# EAGLE design Poludapter_v2 (EAGLE 9.1.1)
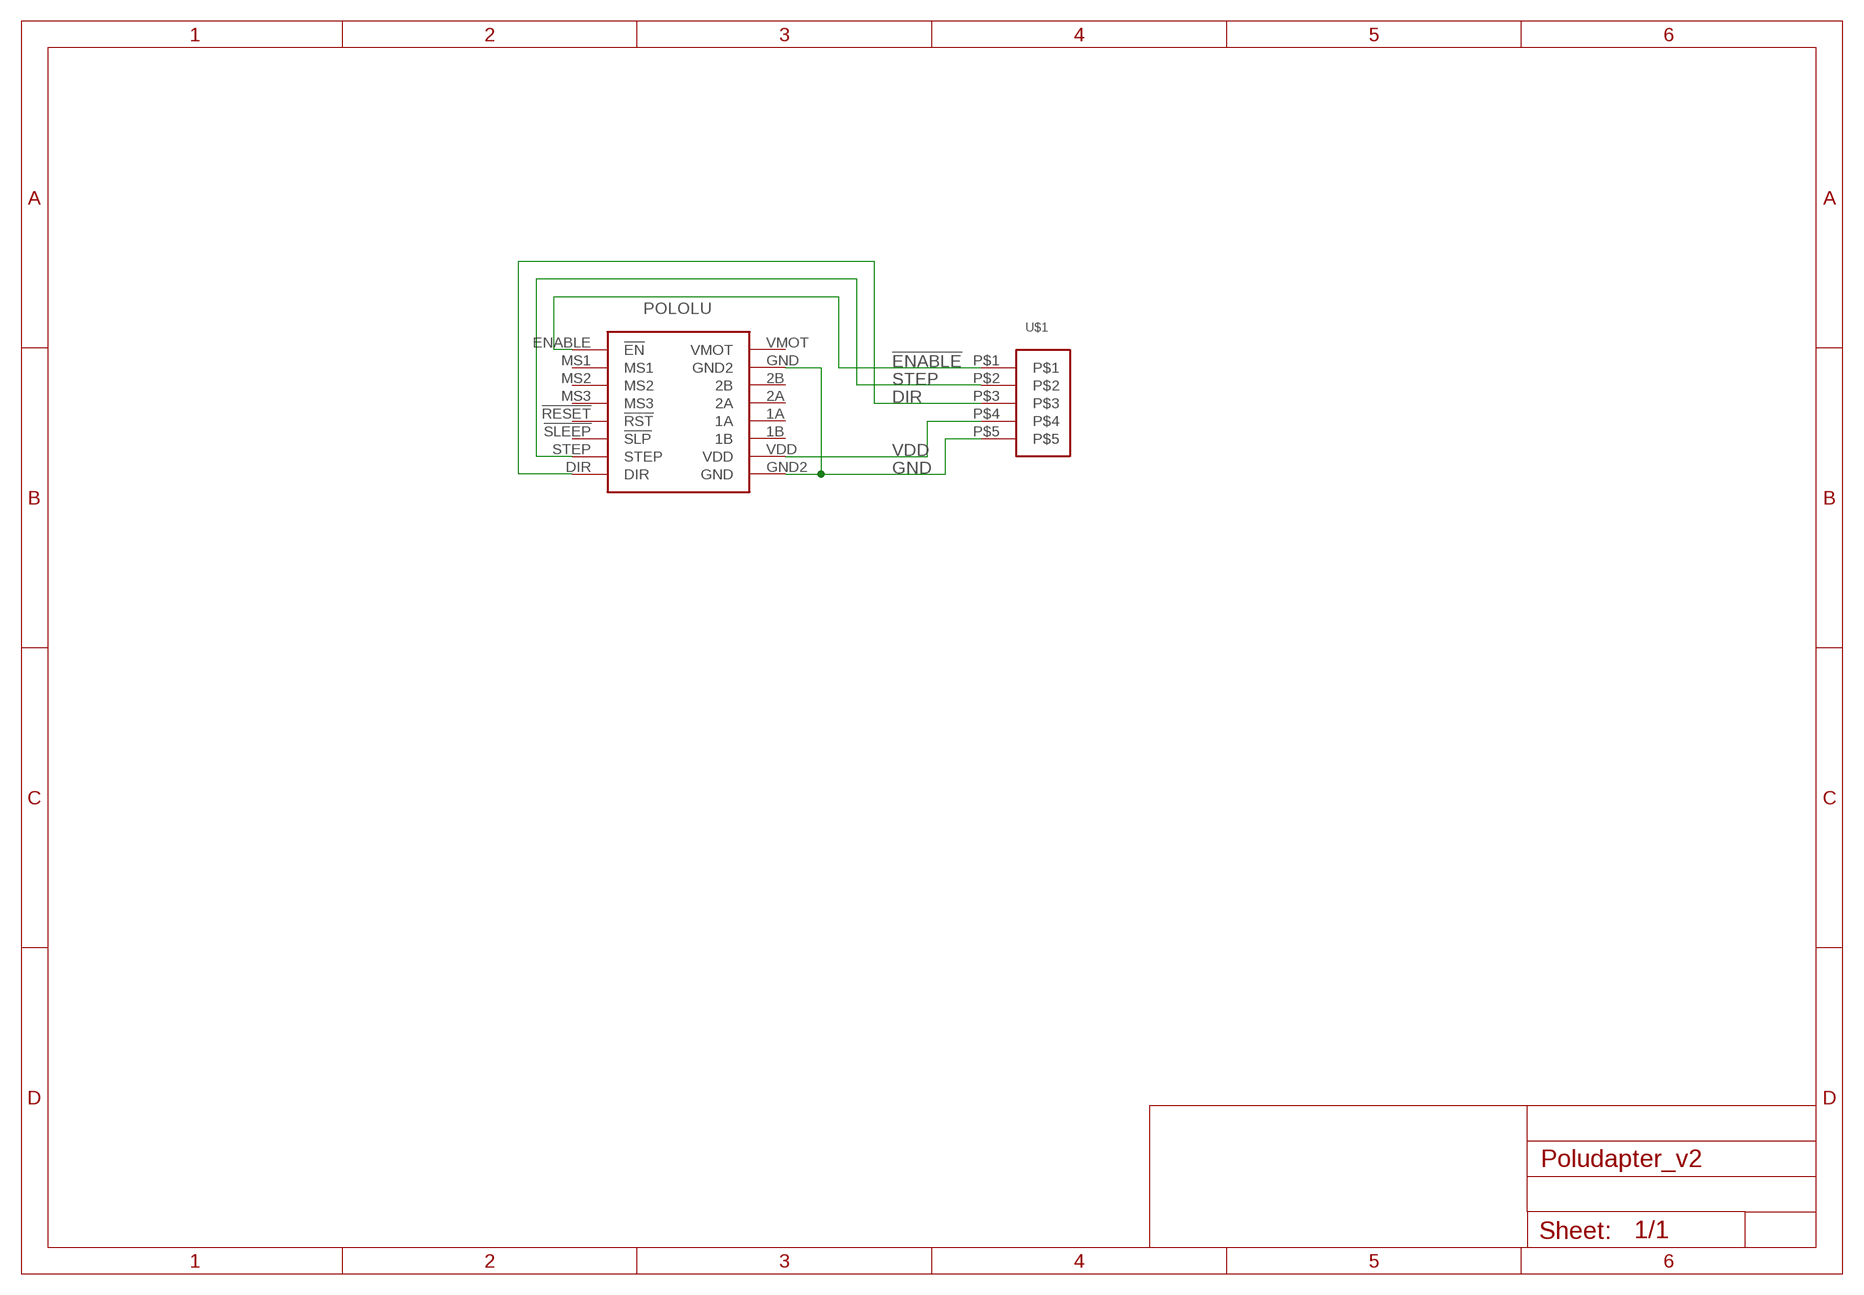
[diagram p0: schematic, sheet 1]

## Parts
POLOLU  POLOLU  [POLOLU]
U$1  TERMINAL  [20020327-D051B01LF]

## Nets
!ENABLE: POLOLU.ENABLE(!EN) U$1.P$1
DIR: POLOLU.DIR U$1.P$3
GND: POLOLU.GND2(GND) POLOLU.GND(GND2) U$1.P$5
STEP: POLOLU.STEP U$1.P$2
VDD: POLOLU.VDD U$1.P$4
Unconnected: POLOLU.1A POLOLU.1B POLOLU.2A POLOLU.2B POLOLU.!RESET(!RST) POLOLU.!SLEEP(!SLP) POLOLU.MS1 POLOLU.MS2 POLOLU.MS3 POLOLU.VMOT

## Library data of the parts
POLOLU = pololu:POLOLU
U$1 = pololu:TERMINAL

## Board
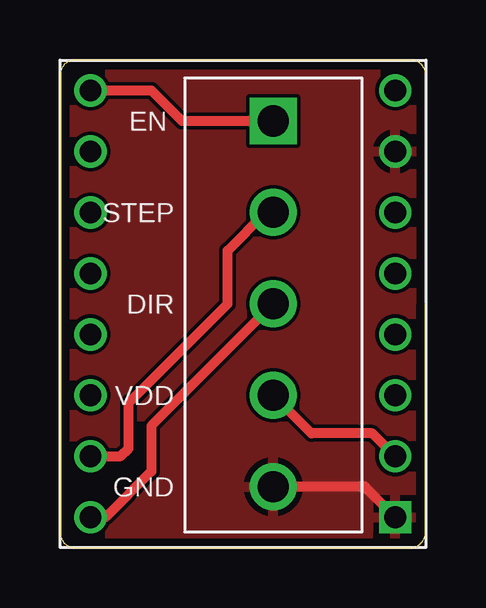
[diagram p1: board, top side]
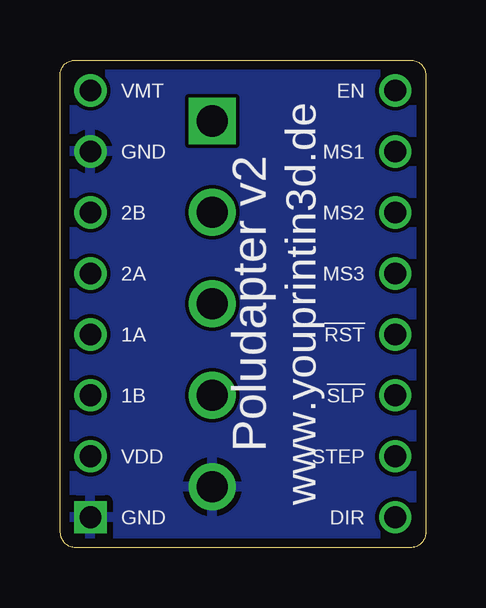
[diagram p2: board, bottom side, seen from below]

Size 15.24 x 20.32 mm. Coordinates in mm from the lower left corner, seen from the top.
Outline: 0,19.69 0,0.63 arc90 0.63,0 14.59,0 arc90 15.22,0.63 15.24,19.69 arc90 14.6,20.32 0.63,20.32 arc90 0,19.69
Copper layers (1*16): Top 0.035559375mm / dielectric 1.6mm / Bottom 0.035559375mm
Design rules "oshpark-2layer": minimum track width 6mil, minimum drill 10mil, track to track 6mil, track to pad 6mil, pad to pad 6mil, via to via 6mil, smd to smd 6mil, copper to edge 15mil, drill to drill 6mil, minimum pad ring 5mil, minimum via ring 5mil, stop-mask expansion 2.5mil, vias tented up to drill 0mil, thermal gap 10mil

### Footprints (pad centres in the part's own frame; a part is rotated, then mirrored left to right if it is on the bottom)
POLOLU = drill 0.9: 1A 6.35,-1.27; 1B 6.35,-3.81; 2A 6.35,1.27; 2B 6.35,3.81; !RESET -6.35,-1.27; !SLEEP -6.35,-3.81; DIR -6.35,-8.89; ENABLE -6.35,8.89; GND 6.35,6.35; MS1 -6.35,6.35; MS2 -6.35,3.81; MS3 -6.35,1.27; STEP -6.35,-6.35; VDD 6.35,-6.35; VMOT 6.35,8.89 | drill 0.9 square: GND2 6.35,-8.89
20020327-D051B01LF = drill 1.3 square: P$1 0,7.62 | drill 1.3: P$2 0,3.81; P$3 0,0; P$4 0,-3.81; P$5 0,-7.62

### Placement (x,y rotation side)
POLOLU  7.62,10.16 0 top
U$1  8.89,10.16 0 top

### Tracks (layer width: path | path; a pad name or v marks a point on that pad's centre or on a via)
!ENABLE
  Top 0.406: POLOLU.ENABLE 3.81,19.05 5.08,17.78 U$1.P$1
DIR
  Top 0.406: POLOLU.DIR 1.91,1.27 3.81,3.17 3.81,5.08 U$1.P$3
GND
  Top 0.406: POLOLU.GND2 12.7,2.54 U$1.P$5
  pour Top: 0,20.32 15.24,20.32 15.24,0 0,0
  pour Bottom: 0,20.32 15.24,20.32 15.24,0 0,0
STEP
  Top 0.406: POLOLU.STEP 2.54,3.81 2.86,4.13 2.86,6.03 6.99,10.16 6.99,12.38 8.57,13.97 U$1.P$2
VDD
  Top 0.406: POLOLU.VDD 13.02,4.76 10.48,4.76 U$1.P$4

### Text on the board
tPlace: EN | STEP | DIR | VDD | GND
bPlace: EN | VMT | MS1 | GND | MS2 | 2B | MS3 | 2A | www.youprintin3d.de | Poludapter v2 | !RST | 1A | !SLP | 1B | STEP | VDD | DIR | GND